# Altium schematic sheet SaidasMotoresCC.SchDoc: CONTROLADORA AIRPOPCORN
size A3; DocumentNumber: 10.00.0025; SheetNumber: 16; SheetTotal: 16
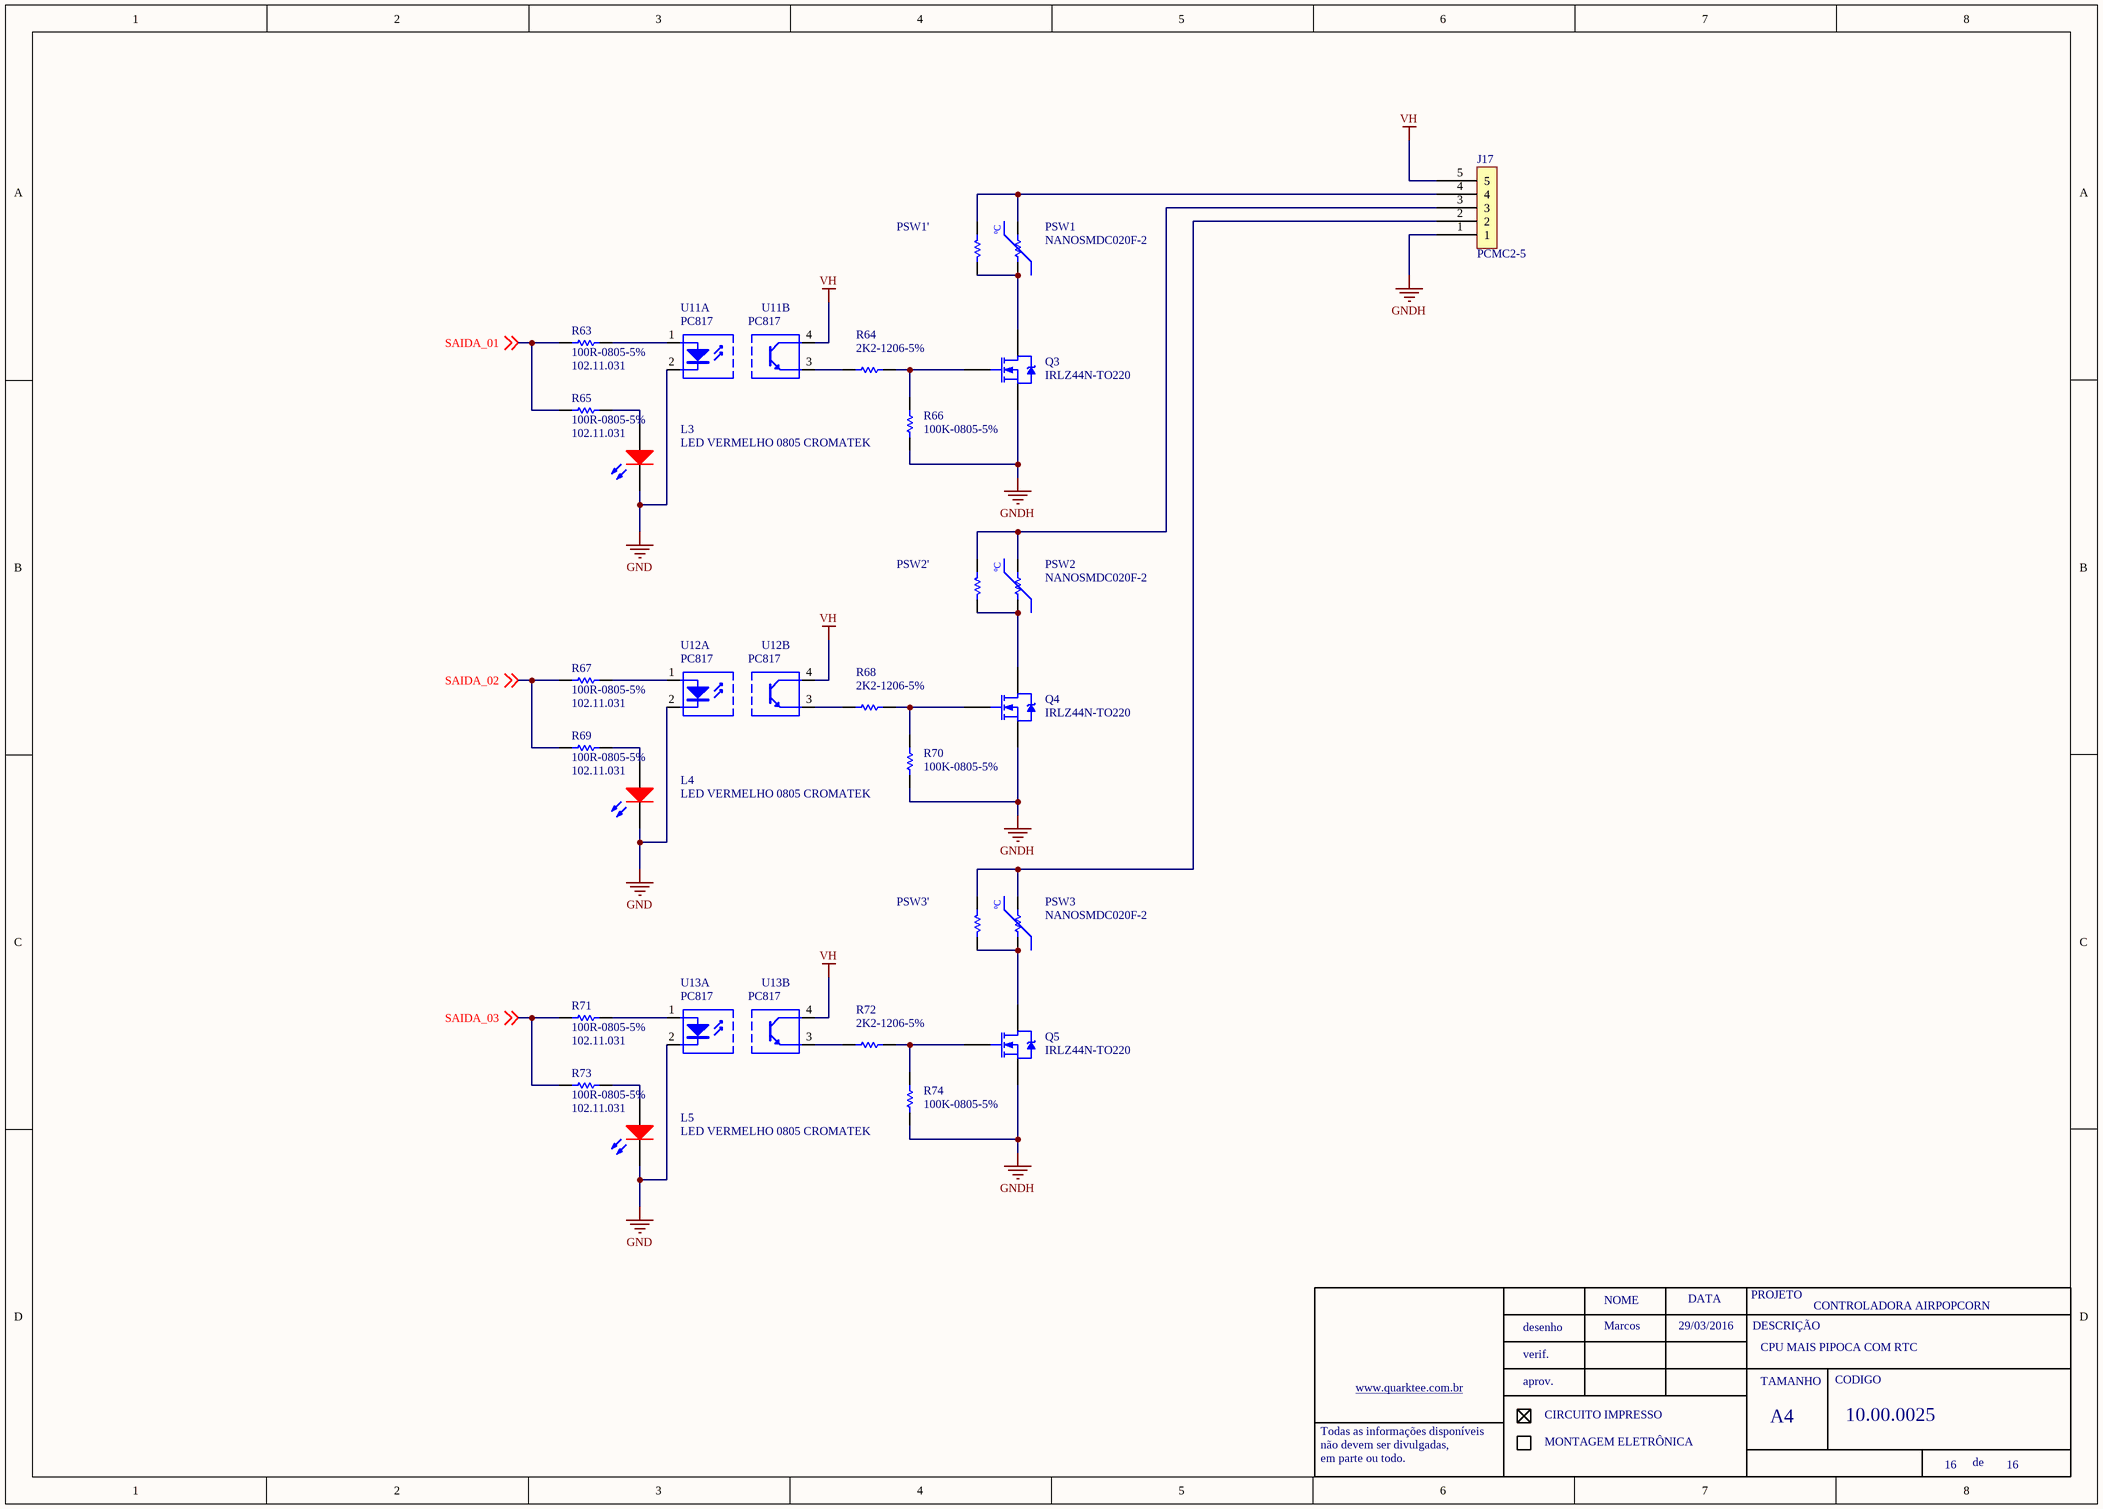
[diagram p0: SaidasMotoresCC.SchDoc]

## Parts
J17  PCMC2-5  [PCMC2-5]
L3  LED VERMELHO 0805 CROMATEK  [LED 0805 - REVI]
L4  LED VERMELHO 0805 CROMATEK  [LED 0805 - REVI]
L5  LED VERMELHO 0805 CROMATEK  [LED 0805 - REVI]
PSW1  NANOSMDC020F-2  [2512 - REVISADO]
PSW1'  (no value)  [1206-REVISADO O]
PSW2  NANOSMDC020F-2  [2512 - REVISADO]
PSW2'  (no value)  [1206-REVISADO O]
PSW3  NANOSMDC020F-2  [2512 - REVISADO]
PSW3'  (no value)  [1206-REVISADO O]
Q3  IRLZ44N-TO220  [TO220-3 EM PÉ]
Q4  IRLZ44N-TO220  [TO220-3 EM PÉ]
Q5  IRLZ44N-TO220  [TO220-3 EM PÉ]
R63  100R-0805-5%  ERP: 102.11.031  [0805-REVISADO O]
R64  2K2-1206-5%  [1206-REVISADO O]
R65  100R-0805-5%  ERP: 102.11.031  [0805-REVISADO O]
R66  100K-0805-5%  [0805-REVISADO O]
R67  100R-0805-5%  ERP: 102.11.031  [0805-REVISADO O]
R68  2K2-1206-5%  [1206-REVISADO O]
R69  100R-0805-5%  ERP: 102.11.031  [0805-REVISADO O]
R70  100K-0805-5%  [0805-REVISADO O]
R71  100R-0805-5%  ERP: 102.11.031  [0805-REVISADO O]
R72  2K2-1206-5%  [1206-REVISADO O]
R73  100R-0805-5%  ERP: 102.11.031  [0805-REVISADO O]
R74  100K-0805-5%  [0805-REVISADO O]
U11  PC817  [DIP-4]  (parts A,B of 2)
U12  PC817  [DIP-4]  (parts A,B of 2)
U13  PC817  [DIP-4]  (parts A,B of 2)

## Nets
GND: L3.2(K) L4.2(K) L5.2(K) U11.2(K) U12.2(K) U13.2(K)
GNDH: J17.1 Q3.3(S) Q4.3(S) Q5.3(S) R66.1 R70.1 R74.1
VH: J17.5 U11.4(C) U12.4(C) U13.4(C)
SAIDA_01: R63.1 R65.1 ; off-sheet SAIDA_01
SAIDA_02: R67.1 R69.1 ; off-sheet SAIDA_02
SAIDA_03: R71.1 R73.1 ; off-sheet SAIDA_03
NetJ17_2: J17.2 PSW3.2 PSW3'.1
NetJ17_3: J17.3 PSW2.2 PSW2'.1
NetJ17_4: J17.4 PSW1.2 PSW1'.1
NetL3_1: L3.1(A) R65.2
NetL4_1: L4.1(A) R69.2
NetL5_1: L5.1(A) R73.2
NetPSW1_1: PSW1.1 PSW1'.2 Q3.2(D)
NetPSW2_1: PSW2.1 PSW2'.2 Q4.2(D)
NetPSW3_1: PSW3.1 PSW3'.2 Q5.2(D)
NetQ3_1: Q3.1(G) R64.1 R66.2
NetQ4_1: Q4.1(G) R68.1 R70.2
NetQ5_1: Q5.1(G) R72.1 R74.2
NetR63_2: R63.2 U11.1(A)
NetR64_2: R64.2 U11.3(E)
NetR67_2: R67.2 U12.1(A)
NetR68_2: R68.2 U12.3(E)
NetR71_2: R71.2 U13.1(A)
NetR72_2: R72.2 U13.3(E)

## Notes on the sheet
- Marcos
- 29/03/2016
- CPU MAIS PIPOCA COM RTC
- NOME
- DATA
- PROJETO
- DESCRIÇÃO
- www.quarktee.com.br
- desenho
- verif.
- aprov.
- TAMANHO
- CODIGO
- Todas as informações disponíveis
- não devem ser divulgadas,
- em parte ou todo.
- CIRCUITO IMPRESSO
- MONTAGEM ELETRÔNICA
- A4
- de
- (in symbol POLYSWITCH 200mA) ºC

## Library data of the parts
L3-L5 = LED VERMELHO 0603 SMD: ERP: 124.02.010
PSW1-PSW3 = POLYSWITCH 200mA: ERP: 128.12.002
PSW1' PSW2' PSW3' R64 R68 R72 = 100K-0805-5%: ERP: 102.11.066
U11-U13 = PC817: OPTOACOPLADOR PC817 DIP-4
Q3-Q5 = IRLZ44N-TO220: ERP: 107.01.006
R66 R70 R74 = 100K-0805-5%: ERP: 102.11.066